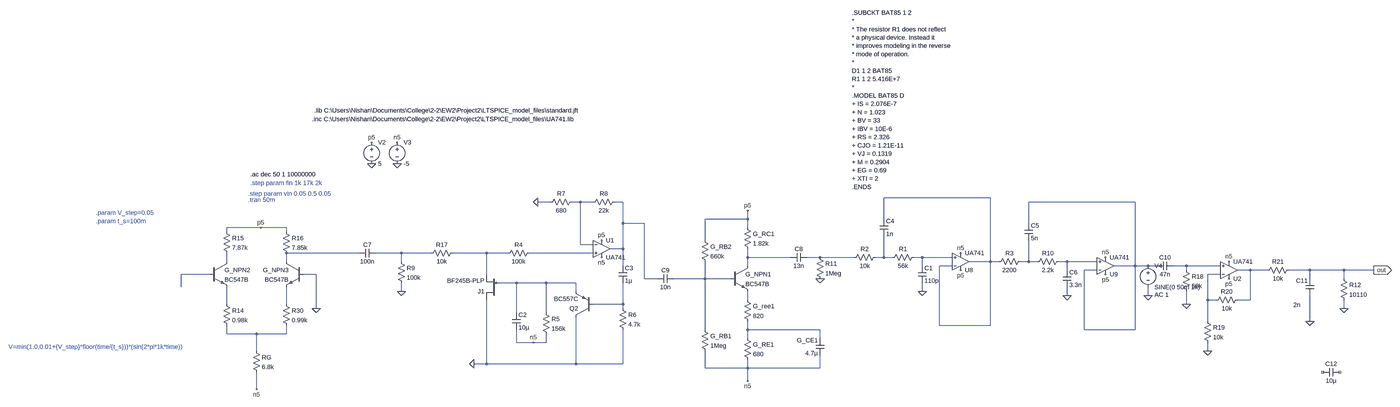
[diagram p0: schematic Full-Circuit.asc, whole sheet]
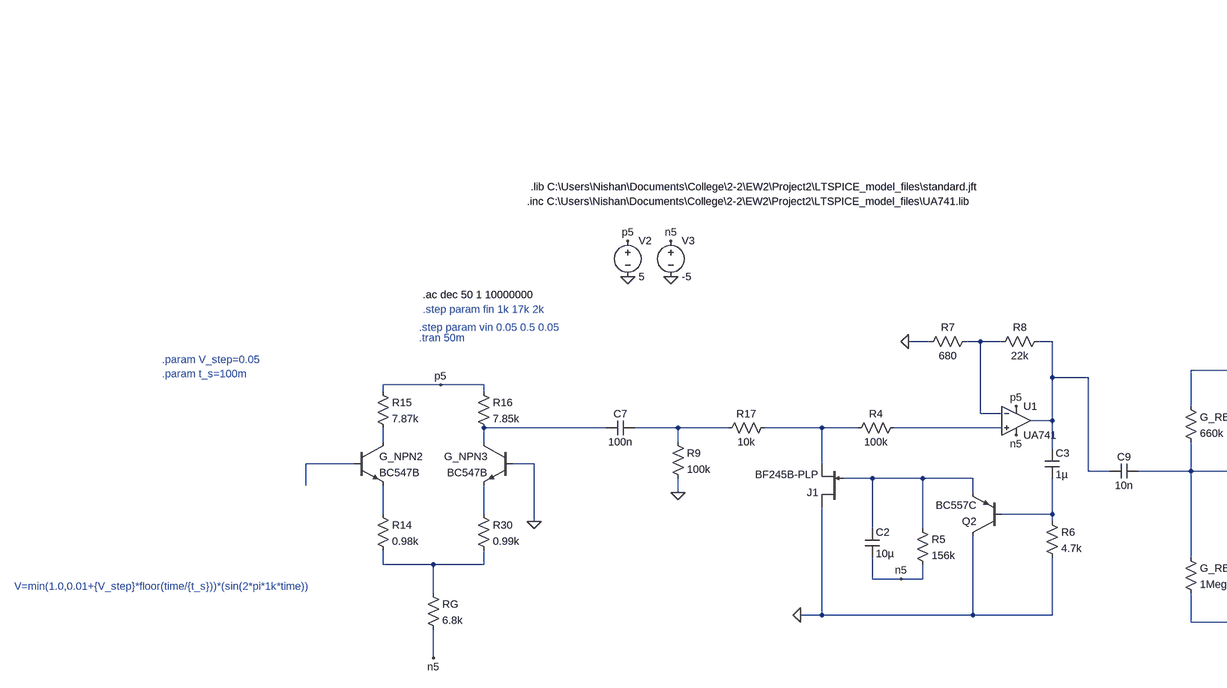
[diagram p1: schematic Full-Circuit.asc, part, row 1 of 1, column 1 of 2]
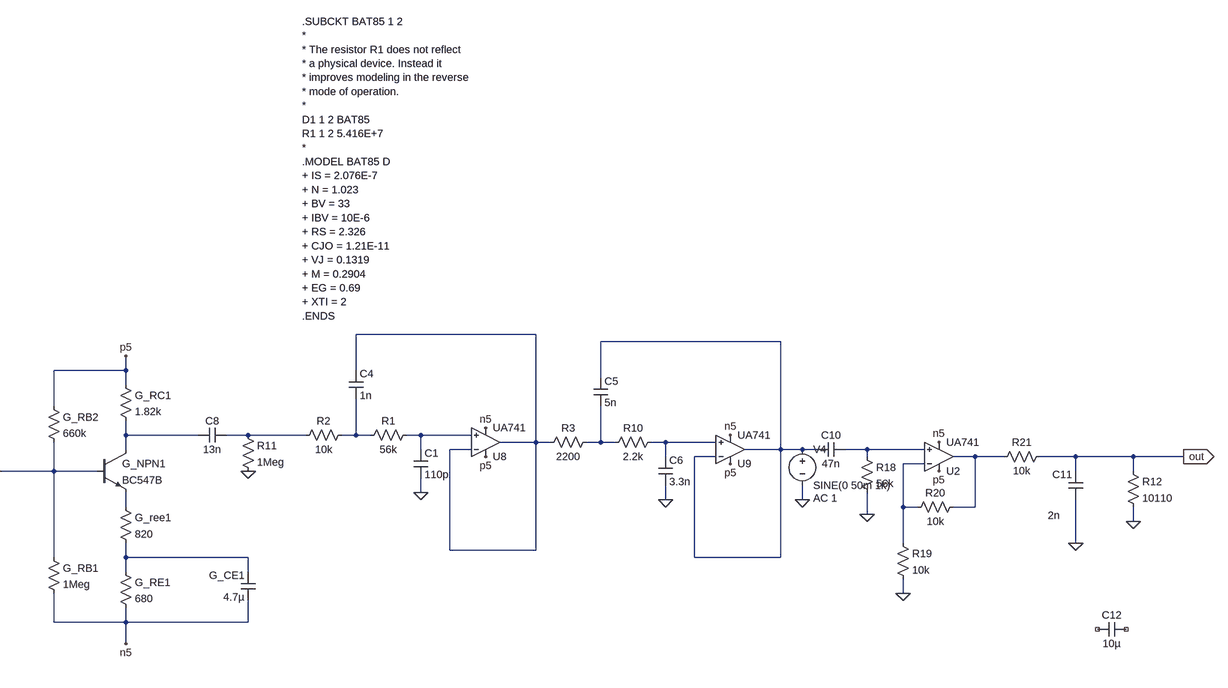
[diagram p2: schematic Full-Circuit.asc, part, row 1 of 1, column 2 of 2]
Full-Circuit.asc, the LTspice schematic file:
Version 4.1
SHEET 1 4496 2220
WIRE 2384 368 1984 368
WIRE 688 384 640 384
WIRE 800 384 768 384
WIRE 848 384 800 384
WIRE 960 384 928 384
WIRE 2928 384 2528 384
WIRE 1472 448 1472 416
WIRE 1472 448 1312 448
WIRE 1984 448 1984 368
WIRE 960 464 960 384
WIRE 1040 464 960 464
WIRE 2528 464 2528 384
WIRE -400 480 -528 480
WIRE -304 480 -400 480
WIRE 1472 480 1472 448
WIRE -528 496 -528 480
WIRE -304 496 -304 480
WIRE 1312 528 1312 448
WIRE 800 544 800 384
WIRE 848 544 800 544
WIRE 960 560 960 464
WIRE 960 560 912 560
WIRE -32 576 -304 576
WIRE 128 576 32 576
WIRE 240 576 128 576
WIRE 448 576 320 576
WIRE 528 576 448 576
WIRE 848 576 608 576
WIRE 1472 592 1472 560
WIRE 1632 592 1472 592
WIRE 1744 592 1696 592
WIRE 1872 592 1744 592
WIRE 1984 592 1984 512
WIRE 1984 592 1952 592
WIRE 2016 592 1984 592
WIRE 2128 592 2096 592
WIRE 2240 592 2128 592
WIRE -528 608 -528 576
WIRE -304 608 -304 576
WIRE 128 608 128 576
WIRE 2384 608 2384 368
WIRE 2384 608 2304 608
WIRE 2416 608 2384 608
WIRE 2528 608 2528 528
WIRE 2528 608 2496 608
WIRE 2560 608 2528 608
WIRE 2672 608 2640 608
WIRE 2784 608 2672 608
WIRE 960 624 960 560
WIRE 1472 624 1472 592
WIRE 2128 624 2128 592
WIRE 2240 624 2192 624
WIRE 2928 624 2928 384
WIRE 2928 624 2848 624
WIRE 2976 624 2928 624
WIRE 3008 624 2976 624
WIRE 3120 624 3072 624
WIRE 3248 624 3120 624
WIRE 2672 640 2672 608
WIRE 2784 640 2736 640
WIRE 3120 640 3120 624
WIRE 3360 640 3312 640
WIRE 3424 640 3360 640
WIRE 3584 640 3504 640
WIRE 3712 640 3584 640
WIRE 3824 640 3712 640
WIRE -592 656 -800 656
WIRE -192 656 -240 656
WIRE 448 656 448 576
WIRE 3248 656 3200 656
WIRE 1040 672 1040 464
WIRE 1088 672 1040 672
WIRE 1312 672 1312 608
WIRE 1312 672 1152 672
WIRE 1408 672 1312 672
WIRE 3584 672 3584 640
WIRE 3712 672 3712 640
WIRE 560 688 496 688
WIRE 672 688 560 688
WIRE 784 688 672 688
WIRE -800 704 -800 656
WIRE 128 720 128 688
WIRE 784 720 784 688
WIRE 2128 720 2128 688
WIRE 2672 736 2672 704
WIRE 2976 736 2976 704
WIRE 1472 752 1472 720
WIRE 3200 752 3200 656
WIRE 3232 752 3200 752
WIRE 3360 752 3360 640
WIRE 3360 752 3312 752
WIRE -528 768 -528 704
WIRE -304 768 -304 704
WIRE 960 768 960 688
WIRE 960 768 848 768
WIRE 3120 768 3120 720
WIRE -192 784 -192 656
WIRE 960 784 960 768
WIRE 3712 784 3712 752
WIRE 560 800 560 688
WIRE 672 800 672 688
WIRE 3200 832 3200 752
WIRE 3584 832 3584 736
WIRE 2192 848 2192 624
WIRE 2384 848 2384 608
WIRE 2384 848 2192 848
WIRE 1312 864 1312 672
WIRE 1472 864 1472 832
WIRE 1744 864 1472 864
WIRE 2736 864 2736 640
WIRE 2928 864 2928 624
WIRE 2928 864 2736 864
WIRE -528 880 -528 848
WIRE -416 880 -528 880
WIRE -304 880 -304 848
WIRE -304 880 -416 880
WIRE 1472 896 1472 864
WIRE 1744 896 1744 864
WIRE 560 912 560 864
WIRE 624 912 560 912
WIRE 672 912 672 880
WIRE 672 912 624 912
WIRE -416 944 -416 880
WIRE 3200 944 3200 912
WIRE 448 992 448 752
WIRE 448 992 400 992
WIRE 784 992 784 816
WIRE 784 992 448 992
WIRE 960 992 960 864
WIRE 960 992 784 992
WIRE 1312 1008 1312 944
WIRE 1472 1008 1472 976
WIRE 1472 1008 1312 1008
WIRE 1744 1008 1744 960
WIRE 1744 1008 1472 1008
WIRE 1472 1056 1472 1008
WIRE -416 1088 -416 1024
FLAG 400 992 0
FLAG 640 384 0
FLAG 624 912 n5
FLAG 880 592 n5
FLAG 880 528 p5
FLAG 16 240 0
FLAG 112 240 0
FLAG 16 160 p5
FLAG 112 160 n5
FLAG 2672 736 0
FLAG 2128 720 0
FLAG 2272 576 n5
FLAG 2272 640 p5
FLAG 2816 592 n5
FLAG 2816 656 p5
FLAG 128 720 0
FLAG 1472 1056 n5
FLAG 1472 416 p5
FLAG 1744 672 0
FLAG 3824 640 out
IOPIN 3824 640 Out
FLAG -416 1088 n5
FLAG -400 480 p5
FLAG -192 784 0
FLAG 3120 768 0
FLAG 3280 608 n5
FLAG 3280 672 p5
FLAG 3200 944 0
FLAG 3712 784 0
FLAG 3584 832 0
FLAG 2976 736 0
DATAFLAG -112 576 ""
DATAFLAG 960 560 ""
DATAFLAG 960 768 ""
DATAFLAG 560 688 ""
DATAFLAG 448 576 ""
DATAFLAG 448 992 ""
DATAFLAG 1248 672 ""
DATAFLAG 1568 592 ""
DATAFLAG -416 880 ""
SYMBOL njf 496 752 R180
SYMATTR InstName J1
SYMATTR Value BF245B-PLP
SYMBOL res 624 560 R90
WINDOW 0 0 56 VBottom 2
WINDOW 3 32 56 VTop 2
SYMATTR InstName R4
SYMATTR Value 100k
SYMBOL cap 544 800 R0
SYMATTR InstName C2
SYMATTR Value 10µ
SYMBOL res 656 784 R0
SYMATTR InstName R5
SYMATTR Value 156k
SYMBOL pnp 848 816 R180
SYMATTR InstName Q2
SYMATTR Value BC557C
SYMBOL res 944 768 R0
SYMATTR InstName R6
SYMATTR Value 4.7k
SYMBOL cap 944 624 R0
SYMATTR InstName C3
SYMATTR Value 1µ
SYMBOL OpAmps\\opamp2 880 496 R0
SYMATTR InstName U1
SYMATTR Value UA741
SYMBOL res 784 368 R90
WINDOW 0 0 56 VBottom 2
WINDOW 3 32 56 VTop 2
SYMATTR InstName R7
SYMATTR Value 680
SYMBOL res 944 368 R90
WINDOW 0 0 56 VBottom 2
WINDOW 3 32 56 VTop 2
SYMATTR InstName R8
SYMATTR Value 22k
SYMBOL voltage 16 144 R0
WINDOW 123 0 0 Left 0
WINDOW 39 0 0 Left 0
SYMATTR InstName V2
SYMATTR Value 5
SYMBOL voltage 112 144 R0
WINDOW 123 0 0 Left 0
WINDOW 39 0 0 Left 0
SYMATTR InstName V3
SYMATTR Value -5
SYMBOL cap 2112 624 R0
SYMATTR InstName C1
SYMATTR Value 110p
SYMBOL res 2000 608 R270
WINDOW 0 32 56 VTop 2
WINDOW 3 0 56 VBottom 2
SYMATTR InstName R1
SYMATTR Value 56k
SYMBOL cap 1968 448 R0
SYMATTR InstName C4
SYMATTR Value 1n
SYMBOL res 1968 576 R90
WINDOW 0 0 56 VBottom 2
WINDOW 3 32 56 VTop 2
SYMATTR InstName R2
SYMATTR Value 10k
SYMBOL res 2512 592 R90
WINDOW 0 0 56 VBottom 2
WINDOW 3 32 56 VTop 2
SYMATTR InstName R3
SYMATTR Value 2200
SYMBOL res 2656 592 R90
WINDOW 0 0 56 VBottom 2
WINDOW 3 32 56 VTop 2
SYMATTR InstName R10
SYMATTR Value 2.2k
SYMBOL cap 2512 464 R0
SYMATTR InstName C5
SYMATTR Value 5n
SYMBOL cap 2656 640 R0
SYMATTR InstName C6
SYMATTR Value 3.3n
SYMBOL OpAmps\\opamp2 2272 672 M180
SYMATTR InstName U8
SYMATTR Value UA741
SYMBOL OpAmps\\opamp2 2816 688 M180
SYMATTR InstName U9
SYMATTR Value UA741
SYMBOL cap 32 560 R90
WINDOW 0 0 32 VBottom 2
WINDOW 3 32 32 VTop 2
SYMATTR InstName C7
SYMATTR Value 100n
SYMBOL res 112 592 R0
SYMATTR InstName R9
SYMATTR Value 100k
SYMBOL res 1296 848 R0
SYMATTR InstName G_RB1
SYMATTR Value 1Meg
SYMBOL res 1296 512 R0
SYMATTR InstName G_RB2
SYMATTR Value 660k
SYMBOL npn 1408 624 R0
SYMATTR InstName G_NPN1
SYMATTR Value BC547B
SYMBOL res 1456 464 R0
SYMATTR InstName G_RC1
SYMATTR Value 1.82k
SYMBOL res 1456 880 R0
SYMATTR InstName G_RE1
SYMATTR Value 680
SYMBOL res 1456 736 R0
SYMATTR InstName G_ree1
SYMATTR Value 820
SYMBOL cap 1760 960 R180
WINDOW 0 24 56 Left 2
WINDOW 3 24 8 Left 2
SYMATTR InstName G_CE1
SYMATTR Value 4.7µ
SYMBOL cap 1696 576 R90
WINDOW 0 0 32 VBottom 2
WINDOW 3 32 32 VTop 2
SYMATTR InstName C8
SYMATTR Value 13n
SYMBOL res 1728 576 R0
SYMATTR InstName R11
SYMATTR Value 1Meg
SYMBOL cap 1152 656 R90
WINDOW 0 0 32 VBottom 2
WINDOW 3 32 32 VTop 2
SYMATTR InstName C9
SYMATTR Value 10n
SYMBOL npn -592 608 R0
SYMATTR InstName G_NPN2
SYMATTR Value BC547B
SYMBOL npn -240 608 M0
SYMATTR InstName G_NPN3
SYMATTR Value BC547B
SYMBOL res -432 928 R0
SYMATTR InstName RG
SYMATTR Value 6.8k
SYMBOL res -544 480 R0
SYMATTR InstName R15
SYMATTR Value 7.87k
SYMBOL res -320 480 R0
SYMATTR InstName R16
SYMATTR Value 7.85k
SYMBOL res -544 752 R0
SYMATTR InstName R14
SYMATTR Value 0.98k
SYMBOL res -320 752 R0
SYMATTR InstName R30
SYMATTR Value 0.99k
SYMBOL res 336 560 R90
WINDOW 0 0 56 VBottom 2
WINDOW 3 32 56 VTop 2
SYMATTR InstName R17
SYMATTR Value 10k
SYMBOL OpAmps\\opamp2 3280 704 M180
SYMATTR InstName U2
SYMATTR Value UA741
SYMBOL cap 3072 608 R90
WINDOW 0 0 32 VBottom 2
WINDOW 3 32 32 VTop 2
SYMATTR InstName C10
SYMATTR Value 47n
SYMBOL res 3104 624 R0
SYMATTR InstName R18
SYMATTR Value 56k
SYMBOL res 3184 816 R0
SYMATTR InstName R19
SYMATTR Value 10k
SYMBOL res 3328 736 R90
WINDOW 0 0 56 VBottom 2
WINDOW 3 32 56 VTop 2
SYMATTR InstName R20
SYMATTR Value 10k
SYMBOL res 3520 624 R90
WINDOW 0 0 56 VBottom 2
WINDOW 3 32 56 VTop 2
SYMATTR InstName R21
SYMATTR Value 10k
SYMBOL cap 3600 736 R180
WINDOW 0 24 56 Left 2
WINDOW 3 51 -35 Left 2
SYMATTR InstName C11
SYMATTR Value 2n
SYMBOL res 3696 656 R0
SYMATTR InstName R12
SYMATTR Value 10110
SYMBOL voltage 2976 608 R0
WINDOW 123 24 124 Left 2
WINDOW 39 0 0 Left 0
SYMATTR InstName V4
SYMATTR Value SINE(0 50m 1k)
SYMATTR Value2 AC 1
SYMBOL cap 3696 1008 R90
WINDOW 0 0 32 VBottom 2
WINDOW 3 32 32 VTop 2
SYMATTR InstName C12
SYMATTR Value 10µ
TEXT -200 40 Left 2 !.lib C:\\Users\\Nishan\\Documents\\College\\2-2\\EW2\\Project2\\LTSPICE_model_files\\standard.jft
TEXT -208 72 Left 2 !.inc C:\\Users\\Nishan\\Documents\\College\\2-2\\EW2\\Project2\\LTSPICE_model_files\\UA741.lib
TEXT -448 376 Left 2 ;.tran 50m
TEXT -440 280 Left 2 !.ac dec 50 1 10000000
TEXT -440 312 Left 2 ;.step param fin 1k 17k 2k
TEXT 1864 -328 Left 2 !.SUBCKT BAT85 1 2\n*\n* The resistor R1 does not reflect\n* a physical device. Instead it\n* improves modeling in the reverse\n* mode of operation.\n*\nD1 1 2 BAT85\nR1 1 2 5.416E+7 \n* \n.MODEL BAT85 D \n+ IS = 2.076E-7 \n+ N = 1.023 \n+ BV = 33 \n+ IBV = 10E-6 \n+ RS = 2.326 \n+ CJO = 1.21E-11 \n+ VJ = 0.1319 \n+ M = 0.2904 \n+ EG = 0.69 \n+ XTI = 2 \n.ENDS
TEXT -448 352 Left 2 ;.step param vin 0.05 0.5 0.05
TEXT -1120 456 Left 2 ;.param t_s=100m
TEXT -1448 928 Left 2 ;V=min(1.0,0.01+{V_step}*floor(time/{t_s}))*(sin(2*pi*1k*time))
TEXT -1120 424 Left 2 ;.param V_step=0.05

The netlist it stands for:
* Full-Circuit.asc
J1 0 N021 N007 BF245B-PLP
R4 N008 N007 100k
C2 N021 n5 10µ
R5 N021 n5 156k
Q2 0 N025 N021 0 BC557C
R6 N025 0 4.7k
C3 N003 N025 1µ
X§U1 N008 N002 p5 n5 N003 UA741  ; pins In+ In- V+ V- OUT
R7 N002 0 680
R8 N003 N002 22k
V2 p5 0 5
V3 n5 0 -5
C1 N012 0 110p
R1 N011 N012 56k
C4 N001 N011 1n
R2 N011 N010 10k
R3 N014 N001 2200
R10 N015 N014 2.2k
C5 N004 N014 5n
C6 N015 0 3.3n
X§U8 N012 N001 p5 n5 N001 UA741  ; pins In+ In- V+ V- OUT
X§U9 N015 N004 p5 n5 N004 UA741  ; pins In+ In- V+ V- OUT
C7 N006 N005 100n
R9 N006 0 100k
R§G_RB1 N020 n5 1Meg
R§G_RB2 p5 N020 660k
Q§G_NPN1 N009 N020 N022 0 BC547B
R§G_RC1 p5 N009 1.82k
R§G_RE1 N026 n5 680
R§G_ree1 N022 N026 820
C§G_CE1 n5 N026 4.7µ
C8 N010 N009 13n
R11 N010 0 1Meg
C9 N020 N003 10n
Q§G_NPN2 N013 N018 N023 0 BC547B
Q§G_NPN3 N005 0 N024 0 BC547B
RG N027 n5 6.8k
R15 p5 N013 7.87k
R16 p5 N005 7.85k
R14 N023 N027 0.98k
R30 N024 N027 0.99k
R17 N007 N006 10k
X§U2 N016 N019 p5 n5 N017 UA741  ; pins In+ In- V+ V- OUT
C10 N016 N004 47n
R18 N016 0 56k
R19 N019 0 10k
R20 N017 N019 10k
R21 out N017 10k
C11 0 out 2n
R12 out 0 10110
V4 N004 0 SINE(0 50m 1k) AC 1
C12 NC_01 NC_02 10µ
.model NPN NPN
.model PNP PNP
.lib standard.bjt
.model NJF NJF
.model PJF PJF
.lib standard.jft
.lib C:\Users\Nishan\Documents\College\2-2\EW2\Project2\LTSPICE_model_files\standard.jft
.inc C:\Users\Nishan\Documents\College\2-2\EW2\Project2\LTSPICE_model_files\UA741.lib
* .tran 50m
.ac dec 50 1 10000000
* .step param fin 1k 17k 2k
.SUBCKT BAT85 1 2
*
* The resistor R1 does not reflect
* a physical device. Instead it
* improves modeling in the reverse
* mode of operation.
*
D1 1 2 BAT85
R1 1 2 5.416E+7
*
.MODEL BAT85 D
+ IS = 2.076E-7
+ N = 1.023
+ BV = 33
+ IBV = 10E-6
+ RS = 2.326
+ CJO = 1.21E-11
+ VJ = 0.1319
+ M = 0.2904
+ EG = 0.69
+ XTI = 2
.ENDS
* .step param vin 0.05 0.5 0.05
* .param t_s=100m
* V=min(1.0,0.01+{V_step}*floor(time/{t_s}))*(sin(2*pi*1k*time))
* .param V_step=0.05
.backanno
.end